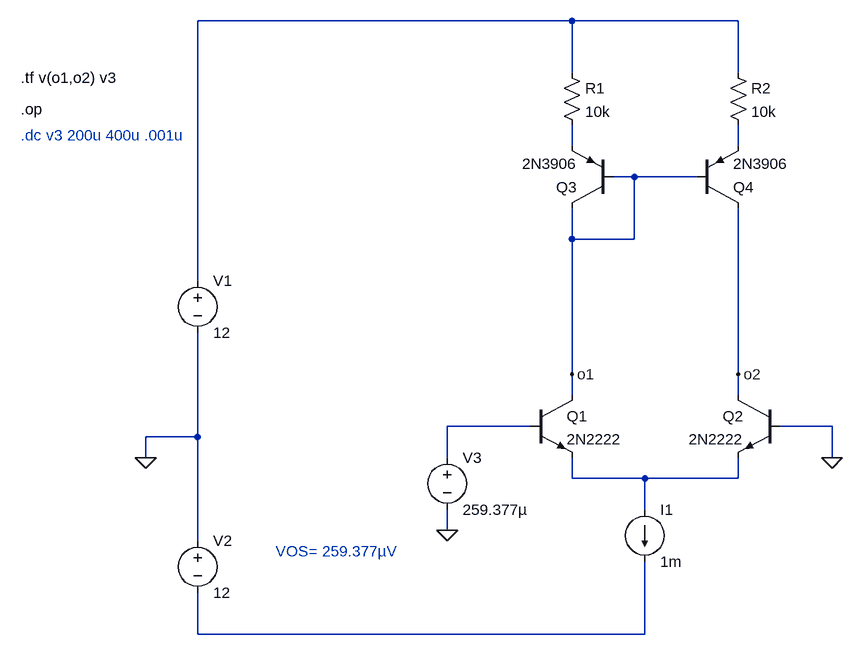
[diagram p0: schematic diferencial2.asc]
diferencial2.asc, the LTspice schematic file:
Version 4
SHEET 1 2196 680
WIRE 176 -448 -400 -448
WIRE 432 -448 176 -448
WIRE 176 -368 176 -448
WIRE 432 -368 432 -448
WIRE 176 -256 176 -288
WIRE 432 -256 432 -288
WIRE 272 -208 240 -208
WIRE 368 -208 272 -208
WIRE 176 -112 176 -160
WIRE 272 -112 272 -208
WIRE 272 -112 176 -112
WIRE -400 -48 -400 -448
WIRE 176 96 176 -112
WIRE 432 96 432 -160
WIRE 176 128 176 96
WIRE 432 128 432 96
WIRE 112 176 -16 176
WIRE 576 176 496 176
WIRE -400 192 -400 32
WIRE -400 192 -480 192
WIRE -480 224 -480 192
WIRE -16 224 -16 176
WIRE 576 224 576 176
WIRE 176 256 176 224
WIRE 288 256 176 256
WIRE 432 256 432 224
WIRE 432 256 288 256
WIRE 288 304 288 256
WIRE -16 336 -16 304
WIRE -400 352 -400 192
WIRE -400 496 -400 432
WIRE 288 496 288 384
WIRE 288 496 -400 496
FLAG -480 224 0
FLAG 576 224 0
FLAG -16 336 0
FLAG 176 96 o1
FLAG 432 96 o2
DATAFLAG 288 256 ""
DATAFLAG 176 -32 ""
DATAFLAG 432 -32 ""
SYMBOL npn 112 128 R0
SYMATTR InstName Q1
SYMATTR Value 2N2222
SYMBOL npn 496 128 M0
SYMATTR InstName Q2
SYMATTR Value 2N2222
SYMBOL current 288 304 R0
WINDOW 123 0 0 Left 0
WINDOW 39 0 0 Left 0
SYMATTR InstName I1
SYMATTR Value 1m
SYMBOL voltage -400 -64 R0
WINDOW 123 0 0 Left 0
WINDOW 39 0 0 Left 0
SYMATTR InstName V1
SYMATTR Value 12
SYMBOL voltage -400 336 R0
WINDOW 123 0 0 Left 0
WINDOW 39 0 0 Left 0
SYMATTR InstName V2
SYMATTR Value 12
SYMBOL voltage -16 208 R0
WINDOW 123 0 0 Left 0
WINDOW 39 0 0 Left 0
SYMATTR InstName V3
SYMATTR Value 259.377µ
SYMBOL pnp 240 -160 R180
SYMATTR InstName Q3
SYMATTR Value 2N3906
SYMBOL pnp 368 -160 M180
SYMATTR InstName Q4
SYMATTR Value 2N3906
SYMBOL res 160 -384 R0
SYMATTR InstName R1
SYMATTR Value 10k
SYMBOL res 416 -384 R0
SYMATTR InstName R2
SYMATTR Value 10k
TEXT -672 -312 Left 2 !.op
TEXT -672 -272 Left 2 ;.dc v3 200u 400u .001u
TEXT -672 -360 Left 2 !.tf v(o1,o2) v3
TEXT -280 368 Left 2 ;VOS= 259.377µV

The netlist it stands for:
* diferencial2.asc
Q1 o1 N004 N005 0 2N2222
Q2 o2 0 N005 0 2N2222
I1 N005 N006 1m
V1 N001 0 12
V2 0 N006 12
V3 N004 0 259.377µ
Q3 o1 o1 N002 0 2N3906
Q4 o2 o1 N003 0 2N3906
R1 N001 N002 10k
R2 N001 N003 10k
.model NPN NPN
.model PNP PNP
.lib standard.bjt
.op
* .dc v3 200u 400u .001u
.tf v(o1,o2) v3
* VOS= 259.377µV
.backanno
.end